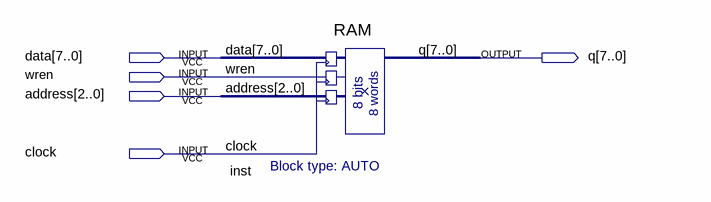
[diagram p0: schematic sheet]
// Quartus schematic RAM8BYTE.bdf as structural Verilog: 1 symbols, 5 pins
module RAM8BYTE (
  input  [7:0] data,
  input  wren,
  input  [2:0] address,
  input  clock,
  output [7:0] q
);

  RAM inst (.data(data), .wren(wren), .address(address), .clock(clock), .q(q));
endmodule
